# EAGLE design 4Show_CE (EAGLE 9.6.2)
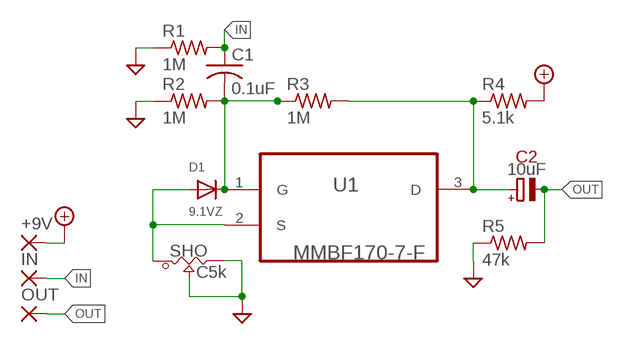
[diagram p0: schematic, sheet 1]

## Parts
+9V  SMD2  [SMD1,27-2,54]
C1  0.1uF  C-USC0603  [C0603]
C2  10uF  PAN_B  [PAN_B]
D1  9.1VZ  DIODESOD-123  [SOD-123]
IN  SMD2  [SMD1,27-2,54]
OUT  SMD2  [SMD1,27-2,54]
R1  1M  R-US_R0603  [R0603]
R2  1M  R-US_R0603  [R0603]
R3  1M  R-US_R0603  [R0603]
R4  5.1k  R-US_R0603  [R0603]
R5  47k  R-US_R0603  [R0603]
SHO  C5k  POT_9MM_SMD  [POT_9MM_SMD]
U1  MMBF170-7-F  [SOT103P240X110-3N]

## Nets
+9V: +9V.1(P) R4.2
GND: R1.1 R2.1 R5.1 SHO.2 SHO.3
IN: C1.1 IN.1(P) R1.2
N$1: C1.2 D1.C R2.2 R3.1 U1.1(G)
N$2: C2.1+(+) R3.2 R4.1 U1.3(D)
N$3: D1.A SHO.1 U1.2(S)
OUT: C2.2-(-) OUT.1(P) R5.2

## Library data of the parts
+9V IN OUT = wirepad:SMD2: SMD PAD
C1 = adafruit:C-US: CAPACITOR, American symbol
C2 = Panasonic_ECap:PAN_B
D1 = adafruit:DIODE: Diode SMADIODE - SMA Surface Mount Package 20V 1A Schottky Diode Digikey: 641-1014-6-ND DO-1N4148 - Through Hole Small Current Diode SOD-123 20V 1 A (.5mV Vf) Schottky Diode - Digikey: MBRX120TPMSCT-ND SOD-323 10V 570mA (.38mV Vf, 3ns) Schottky Diode - Digikey: ZLLS410CT-ND SOD-523 30V 30mA Schottky Diode (RB751S-40TE61) - Digikey: RB751S-40TE61CT-ND SOT23-R/W - SOT23 Package (R = Solder Paste/Reflow Ovens, W = Hand-Soldering) BAT54Film 40V 300mA - Digikey: 497-7162-1-ND
R1-R5 = adafruit:R-US_: RESISTOR, American symbol
SHO = Mech_BO_CE_SW:POT_9MM_SMD
U1 = MMBF170-7-F:MMBF170-7-F: N-CHANNEL ENHANCEMENT MODE FIELD EFFECT TRANSISTOR; AVAILABILITY: Unavailable; DESCRIPTION: N-Channel 60V 500mA _Ta_ 300mW _Ta_ Surface Mount SOT-23-3; MF: Diodes Inc.; MP: MMBF170-7-F; PACKAGE: SOT-23-3 Diodes Inc.; PRICE: None

## Board
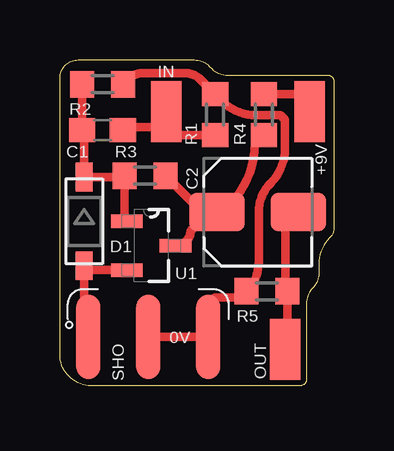
[diagram p1: board, top side]

Size 11.43 x 13.59 mm. Coordinates in mm from the lower left corner, seen from the top.
Outline: 1.3,0 arc-45 0.38,0.38 arc-45 0,1.3 0,12.83 arc-90 0.76,13.59 5.61,13.59 arc-45 6.22,13.34 6.33,13.22 arc45 6.99,12.95 11.18,12.95 arc-90 11.43,12.7 11.43,6.66 arc-45 11.3,6.22 11.24,6.16 arc45 10.79,5.08 10.79,4.68 arc-45 10.54,4.06 arc45 10.29,3.45 10.29,0.25 arc-90 10.03,0 1.3,0
Copper layers (1*16): Top 0.035mm / dielectric 1.5mm / Bottom 0.035mm
Design rules "default *": minimum track width 6mil, minimum drill 0.35mm, track to track 6mil, track to pad 6mil, pad to pad 6mil, via to via 6mil, smd to smd 6mil, copper to edge 10mil, drill to drill 6mil, minimum pad ring 10mil, minimum via ring 8mil, stop-mask expansion 4mil, vias tented up to drill 0mil, thermal gap 10mil

### Footprints (pad centres in the part's own frame; a part is rotated, then mirrored left to right if it is on the bottom)
SMD1,27-2,54 = smd 1.27 x 2.54: 1 0,0
C0603 = smd 1.1 x 1: 1 -0.85,0; 2 0.85,0
PAN_B = smd 2.312 x 1.6: 1+ -1.7,0; 2- 1.7,0
SOD-123 = smd 1.2 x 0.7: A 1.85,0; C -1.85,0
R0603 = smd 1 x 1.1: 1 -0.85,0; 2 0.85,0
POT_9MM_SMD = smd 0.991 x 3.505: 1 -2.5,0; 2 0,0; 3 2.5,0
SOT103P240X110-3N = smd 1.321 x 0.559: 1 -1.016,1.016; 2 -1.016,-1.016; 3 1.016,0

### Placement (x,y rotation side)
+9V  10.41,11.43 0 top
C1  1.78,10.67 180 top
C2  8.26,7.24 0 top
D1  1.02,6.86 270 top
IN  4.45,11.43 0 top
OUT  9.4,1.52 0 top
R1  6.48,11.3 270 top
R2  1.78,12.57 180 top
R3  3.56,8.76 0 top
R4  8.51,11.3 90 top
R5  8.64,3.94 0 top
SHO  3.68,2.03 0 top
U1  3.81,5.84 0 top

### Tracks (layer width: path | path; a pad name or v marks a point on that pad's centre or on a via)
+9V
  Top 0.356: R4.2 10.33,12.15 10.41,12.06 +9V.1
GND
  Top 0.356: R2.1 2.86,12.81 arc-45 3.4,13.03 5.28,13.03 arc-45 5.82,12.81 R1.1 6.75,11.88 arc45 8.19,11.28 9.2,11.28 9.39,11.09 9.39,9.89 arc-45 8.79,8.46 arc45 8.29,7.25 8.29,5.17 arc-45 R5.1 7.53,3.68 6.48,3.68 6.18,3.39 SHO.3 SHO.2
IN
  Top 0.356: C1.1 2.75,10.79 4.32,10.79 | 4.32,10.79 4.45,10.92 IN.1 | R1.2 4.66,10.45 4.32,10.79
N$1
  Top 0.356: U1.1 2.71,6.95 R3.1 2.65,8.71 D1.C 1.02,10.58 C1.2 R2.2
N$2
  Top 0.356: C2.1+ 6.55,7.19 6.17,7.19 5.46,6.48 arc-90 U1.3 | C2.1+ 5.93,7.24 R3.2 | C2.1+ 6.73,7.24 7.11,7.62 arc45 8.13,10.07 R4.1
N$3
  Top 0.356: SHO.1 1.02,2.2 D1.A 1.2,4.83 U1.2
OUT
  Top 0.356: OUT.1 9.49,1.61 R5.2 9.4,4.03 9.4,6.68 C2.2-

### Text on the board
tPlace: 0V